# EasyEDA schematic Sheet_1.json
TITLE: ecg_monitor; REV: 1.0; Date: 2022-11-05; Sheet: 1/1; Drawn By: coolD69; Company: KGEC
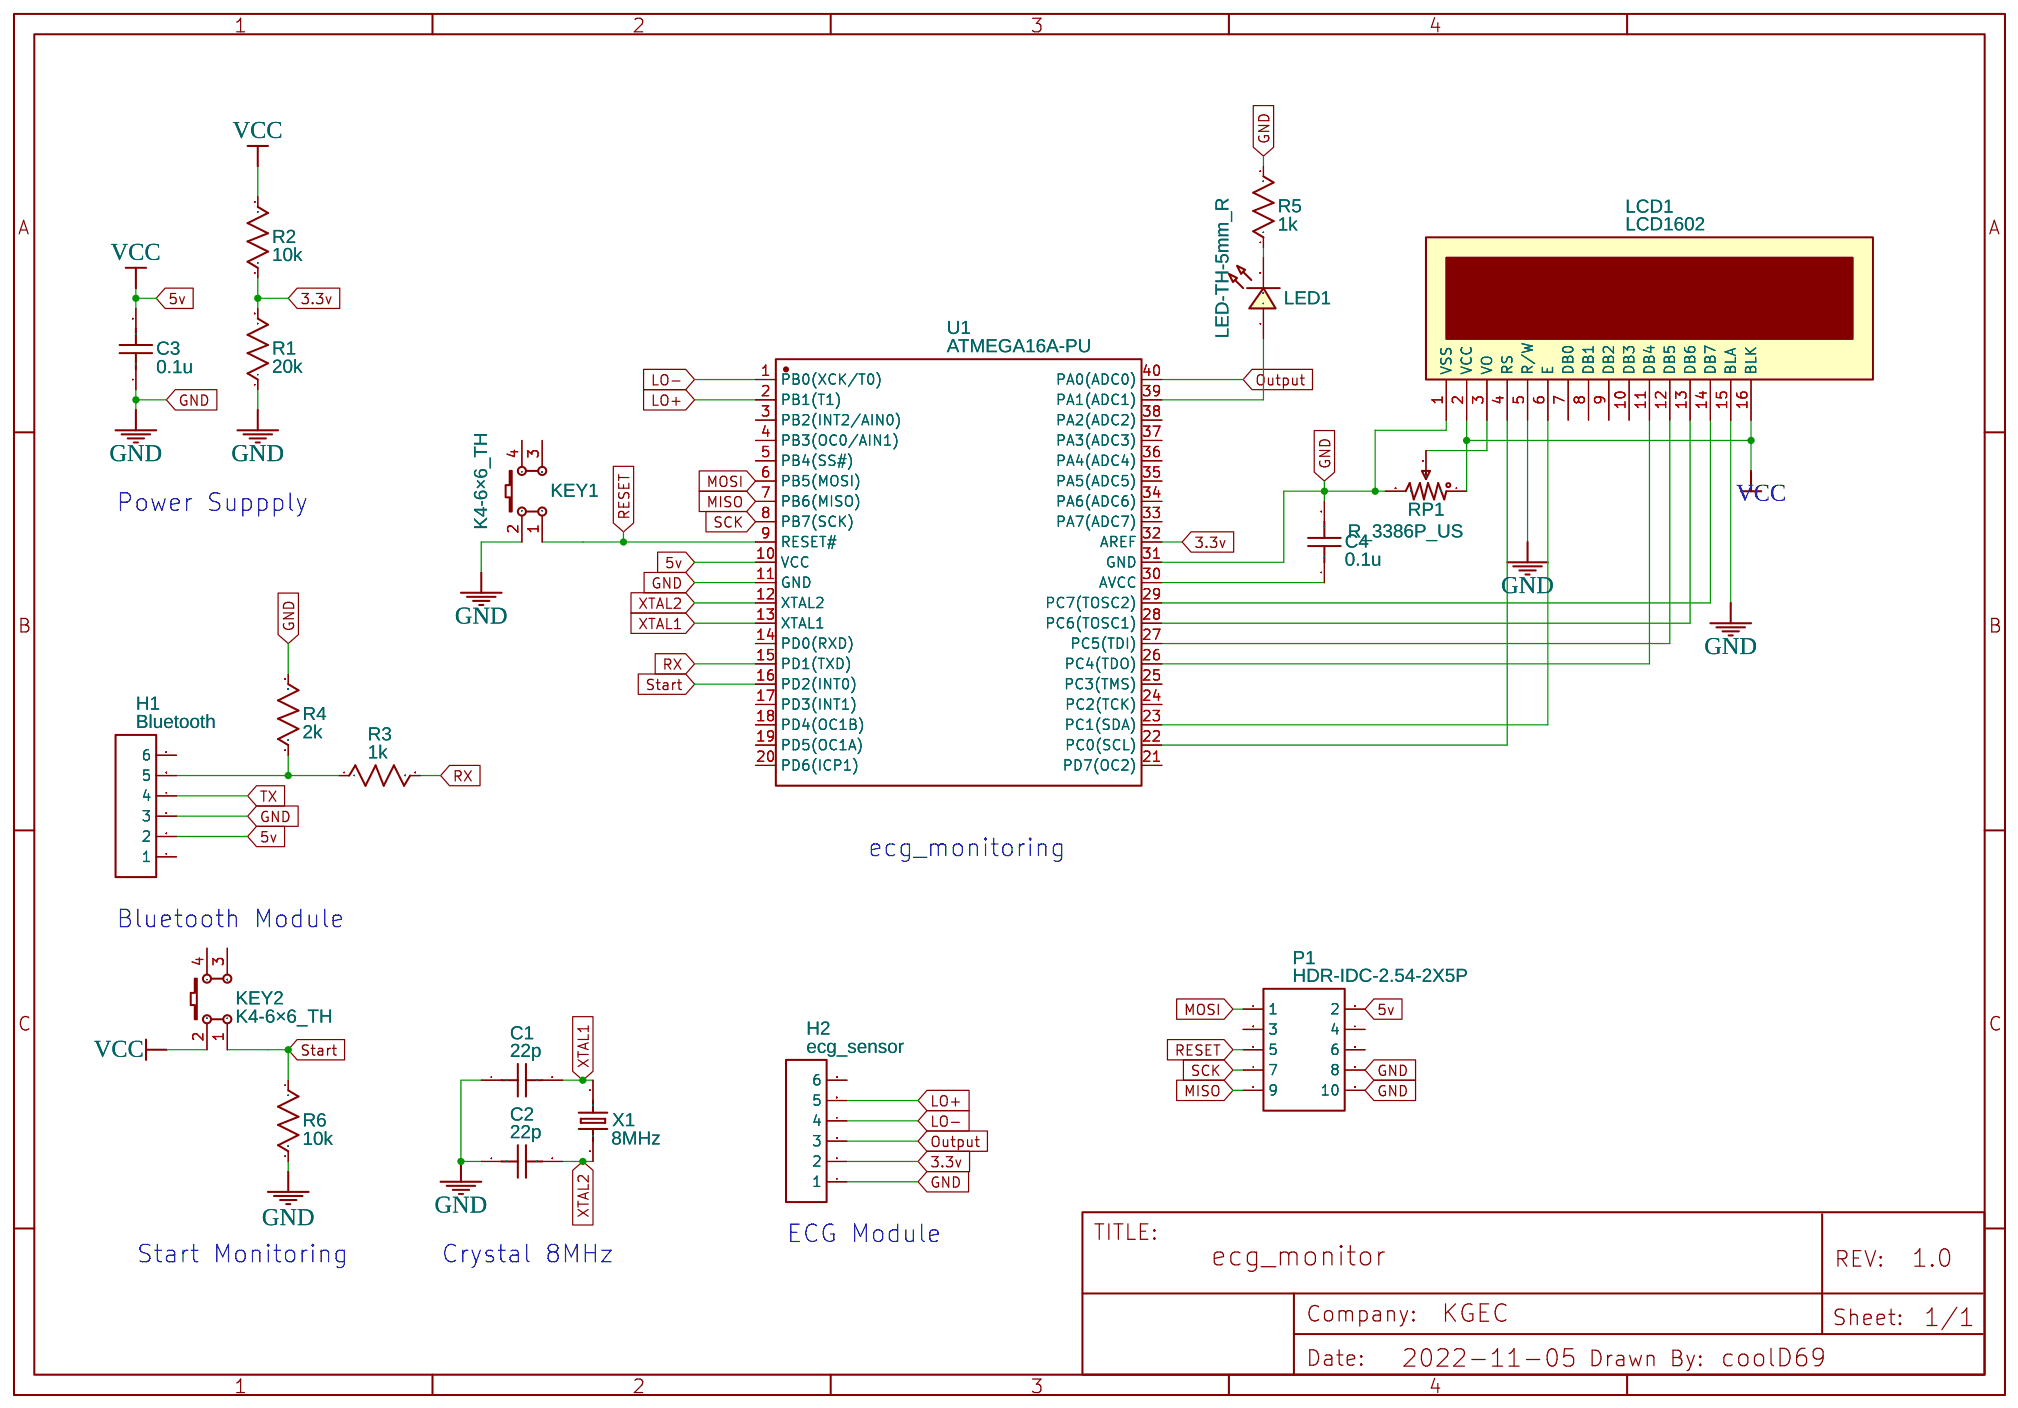
[diagram p0: schematic sheet]

## Parts
C1  22p  [RAD-0.1]
C2  22p  [RAD-0.1]
C3  0.1u  [RAD-0.1]
C4  0.1u  [RAD-0.1]
H1  Bluetooth  [HDR-F-2.54_1X6]
H2  ecg_sensor  [HDR-F-2.54_1X6]
KEY1  K4-6×6_TH  [KEY-TH_4P-L6.0-W6.0-P4.50-LS6.5]
KEY2  K4-6×6_TH  [KEY-TH_4P-L6.0-W6.0-P4.50-LS6.5]
LCD1  LCD1602  [LCD1602]
LED1  LED-TH-5mm_R  [LED-TH_BD5.0_RED]
P1  HDR-IDC-2.54-2X5P  [IDC-TH_10P-P2.54_C5665]
R1  20k  [R_AXIAL-0.5]
R2  10k  [R_AXIAL-0.5]
R3  1k  [R_AXIAL-0.5]
R4  2k  [R_AXIAL-0.5]
R5  1k  [R_AXIAL-0.5]
R6  10k  [R_AXIAL-0.5]
RP1  R_3386P_US  [RES-ADJ-TH_3386P]
U1  ATMEGA16A-PU  [DIP-40_L52.3-W13.9-P2.54-LS15.2-BL]
X1  8MHz  [HC-49US_L11.5-W4.5-P4.88]

## Library data of the parts
C1-C4 = C_RAD-0.1_US: Contributor: LCEDA_Lib
H1 H2 = HDR-F-2.54_1x6: Supplier Part: C40877; Supplier: LCSC; Contributor: LCEDA_Lib
KEY1 KEY2 = K4-6×6_TH: Supplier: LCSC; Supplier Part: C136684; Manufacturer: 韩国韩荣; Manufacturer Part: K2-1102DP-E4SW-04; Contributor: LCEDA_Lib
LCD1 = LCD1602: Manufacturer: LONTECH(厦门龙特); Manufacturer Part: LCM1602K-NSW-BBW; Supplier Part: C83275; Supplier: LCSC; Contributor: LCEDA_Lib
LED1 = LED-TH-5mm_R: Manufacturer: EVERLIGHT(台湾亿光); Manufacturer Part: 333-2SURD/S530-A3; Supplier Part: C87271; Supplier: LCSC; Contributor: LCEDA_Lib
P1 = HDR-IDC-2.54-2X5P: Supplier: LCSC; Manufacturer: BOOMELE; Manufacturer Part: IDC Box 2.54mm 2X5P; image: //image.lceda.cn/szlcsc/C5665.jpg; Supplier Part: C5665
R1-R6 = R_AXIAL-0.5_US: Contributor: LCEDA_Lib
RP1 = R_3386P_US: Supplier: LCSC; Contributor: LCEDA_Lib; value(Ω): 10K
U1 = ATMEGA16A-PU: Supplier: LCSC; Manufacturer: MICROCHIP; Supplier Part: C30504; JLCPCB Part Class: Extended Part
X1 = HC-49S12MHZ20PF30PPM: Supplier: LCSC; Manufacturer: TAE(雅晶鑫); Manufacturer Part: TAXD12M2GLFBET2T; Contributor: LCSC; Supplier Part: C127674; JLCPCB Part Class: Extended Part

## Nets
3.3v: H2.2 R1.2 R2.1 U1.32(AREF)
5v: C3.2 H1.2 KEY2.2 LCD1.2(VCC) LCD1.16(BLK) P1.2 R2.2 RP1.1 U1.10(VCC)
GND: C1.1 C2.1 C3.1 C4.2 H1.3 H2.1 KEY1.2 LCD1.1(VSS) LCD1.5(R/W) LCD1.15(BLA) P1.8 P1.10 R1.1 R4.2 R5.2 R6.2 RP1.3 U1.11(GND) U1.31(GND)
LO+: H2.5 U1.2(PB1(T1))
LO-: H2.4 U1.1(PB0(XCK/T0))
MISO: P1.9 U1.7(PB6(MISO))
MOSI: P1.1 U1.6(PB5(MOSI))
Output: H2.3 U1.40(PA0(ADC0))
RESET: KEY1.1 P1.5 U1.9(RESET#)
RX: R3.2 U1.15(PD1(TXD))
SCK: P1.7 U1.8(PB7(SCK))
Start: KEY2.1 R6.1 U1.16(PD2(INT0))
TX: H1.4
XTAL1: C1.2 U1.13(XTAL1) X1.2
XTAL2: C2.2 U1.12(XTAL2) X1.1
Net-(C4-1): C4.1 U1.30(AVCC)
Net-(H1-5): H1.5 R3.1 R4.1
Net-(LCD1-3): LCD1.3(VO) RP1.2
Net-(LCD1-4): LCD1.4(RS) U1.22(PC0(SCL))
Net-(LCD1-6): LCD1.6(E) U1.23(PC1(SDA))
Net-(LCD1-11): LCD1.11(DB4) U1.26(PC4(TDO))
Net-(LCD1-12): LCD1.12(DB5) U1.27(PC5(TDI))
Net-(LCD1-13): LCD1.13(DB6) U1.28(PC6(TOSC1))
Net-(LCD1-14): LCD1.14(DB7) U1.29(PC7(TOSC2))
Net-(LED1-1): LED1.1 U1.39(PA1(ADC1))
Net-(LED1-2): LED1.2 R5.1

Not connected (* = marked no-connect by the designer): H1 1 6; H2 6; KEY1 3 4; KEY2 3 4; LCD1 7(DB0) 8(DB1) 9(DB2) 10(DB3); P1 3 4 6; U1 3(PB2(INT2/AIN0)) 4(PB3(OC0/AIN1)) 5(PB4(SS#)) 14(PD0(RXD)) 17(PD3(INT1)) 18(PD4(OC1B)) 19(PD5(OC1A)) 20(PD6(ICP1)) 21(PD7(OC2)) 24(PC2(TCK)) 25(PC3(TMS)) 33(PA7(ADC7)) 34(PA6(ADC6)) 35(PA5(ADC5)) 36(PA4(ADC4)) 37(PA3(ADC3)) 38(PA2(ADC2))

## Notes on the sheet
- Power Suppply
- ecg_monitoring
- Bluetooth Module
- ECG Module
- Start Monitoring
- Crystal 8MHz
